# Altium schematic sheet MCU.SchDoc
size A4
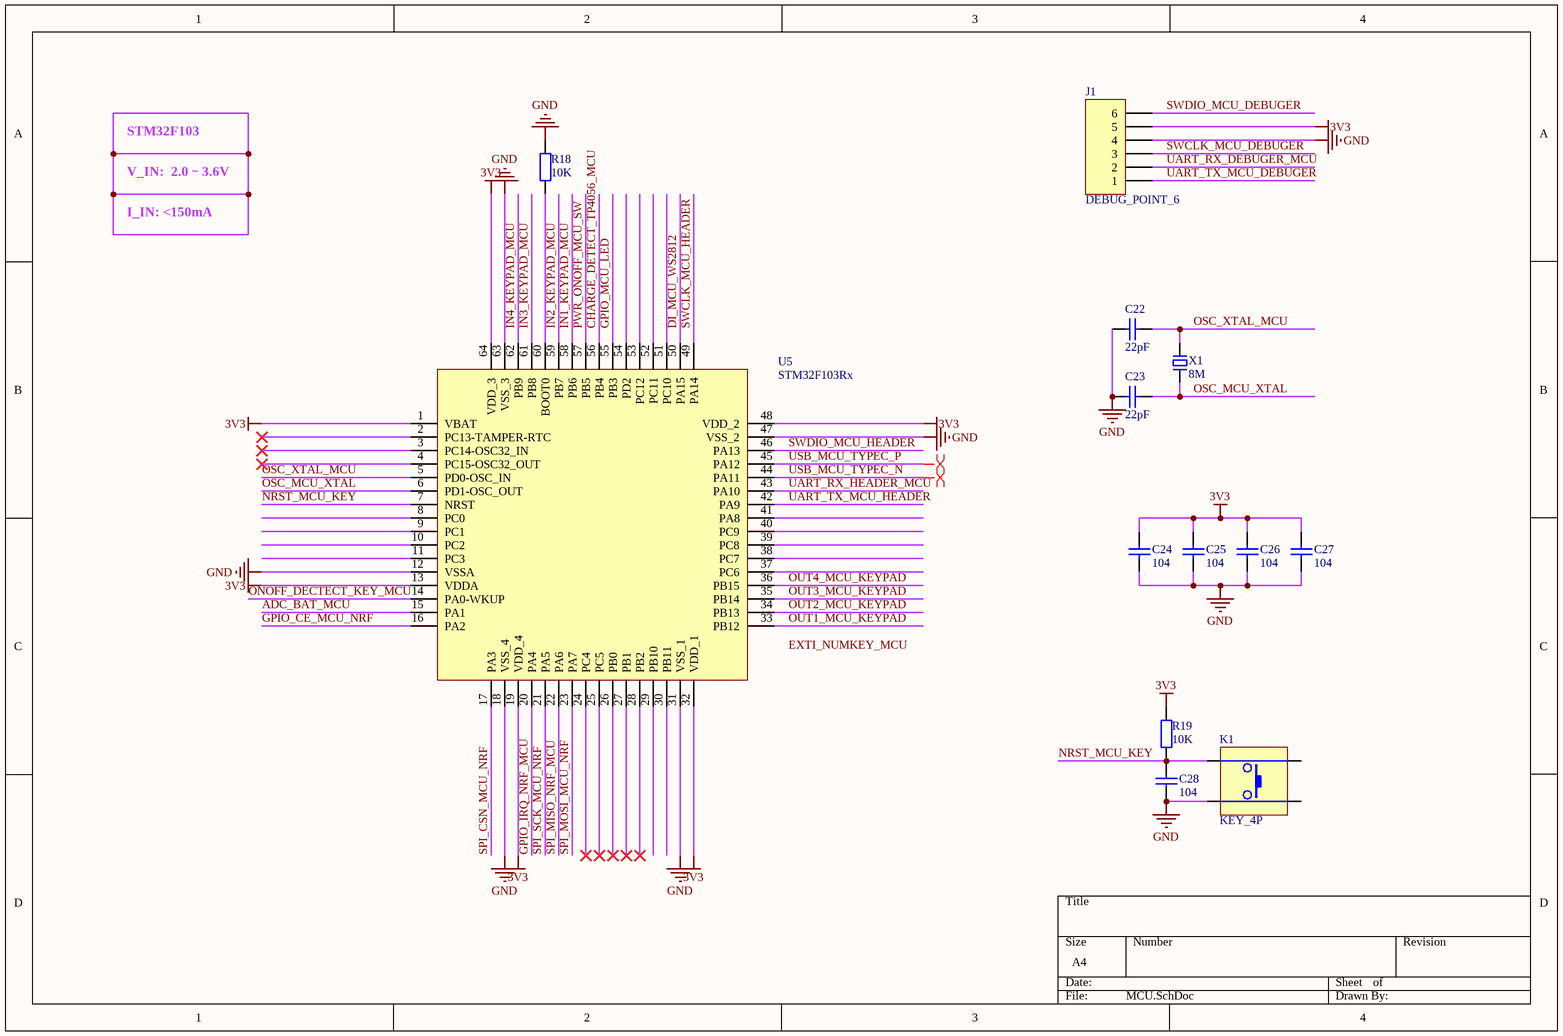
[diagram p0: MCU.SchDoc]

## Parts
C22  22pF  [Cap-0603]
C23  22pF  [Cap-0603]
C24  104  [Cap-0603]
C25  104  [Cap-0603]
C26  104  [Cap-0603]
C27  104  [Cap-0603]
C28  104  [Cap-0603]
J1  DEBUG_POINT_6  [DEBUG_POINT_6]
K1  KEY_4P  [SW-SMD-3X4X2.5]
R18  10K  [Res-0603]
R19  10K  [Res-0603]
U5  STM32F103Rx  [STM-LQFP64_N]
X1  8M  [OSC 5032-2P]

## Nets
3V3: C24.2 C25.2 C26.2 C27.2 J1.5 R19.2 U5.1(VBAT) U5.13(VDDA) U5.19(VDD_4) U5.32(VDD_1) U5.48(VDD_2) U5.64(VDD_3)
GND: C22.1 C23.1 C24.1 C25.1 C26.1 C27.1 C28.1 J1.4 K1.4 R18.2 U5.12(VSSA) U5.18(VSS_4) U5.31(VSS_1) U5.47(VSS_2) U5.63(VSS_3)
ADC_BAT_MCU: U5.15(PA1)
CHARGE_DETECT_TP4056_MCU: U5.56(PB4)
DI_MCU_WS2812: U5.50(PA15)
GPIO_CE_MCU_NRF: U5.16(PA2)
GPIO_IRQ_NRF_MCU: U5.20(PA4)
GPIO_MCU_LED: U5.55(PB3)
IN1_KEYPAD_MCU: U5.58(PB6)
IN2_KEYPAD_MCU: U5.59(PB7)
IN3_KEYPAD_MCU: U5.61(PB8)
IN4_KEYPAD_MCU: U5.62(PB9)
NRST_MCU_KEY: C28.2 K1.3 R19.1 U5.7(NRST)
ONOFF_DECTECT_KEY_MCU: U5.14(PA0-WKUP)
OSC_MCU_XTAL: C23.2 U5.6(PD1-OSC_OUT) X1.1
OSC_XTAL_MCU: C22.2 U5.5(PD0-OSC_IN) X1.2
OUT1_MCU_KEYPAD: U5.33(PB12)
OUT2_MCU_KEYPAD: U5.34(PB13)
OUT3_MCU_KEYPAD: U5.35(PB14)
OUT4_MCU_KEYPAD: U5.36(PB15)
PWR_ONOFF_MCU_SW: U5.57(PB5)
SPI_CSN_MCU_NRF: U5.17(PA3)
SPI_MISO_NRF_MCU: U5.22(PA6)
SPI_MOSI_MCU_NRF: U5.23(PA7)
SPI_SCK_MCU_NRF: U5.21(PA5)
SWCLK_MCU_DEBUGER: J1.3
SWCLK_MCU_HEADER: U5.49(PA14)
SWDIO_MCU_DEBUGER: J1.6
SWDIO_MCU_HEADER: U5.46(PA13)
UART_RX_DEBUGER_MCU: J1.2
UART_RX_HEADER_MCU: U5.43(PA10)
UART_TX_MCU_DEBUGER: J1.1
UART_TX_MCU_HEADER: U5.42(PA9)
USB_MCU_TYPEC_N: U5.44(PA11)
USB_MCU_TYPEC_P: U5.45(PA12)
NetR18_1: R18.1 U5.60(BOOT0)

Not connected (* = marked no-connect by the designer): K1 1 2; U5 2(PC13-TAMPER-RTC)* 3(PC14-OSC32_IN)* 4(PC15-OSC32_OUT)* 8(PC0) 9(PC1) 10(PC2) 11(PC3) 24(PC4)* 25(PC5)* 26(PB0)* 27(PB1)* 28(PB2)* 29(PB10) 30(PB11) 37(PC6) 38(PC7) 39(PC8) 40(PC9) 41(PA8) 51(PC10) 52(PC11) 53(PC12) 54(PD2)

## Layout directives
differential pair: USB_MCU_TYPEC_N, USB_MCU_TYPEC_P

## Notes on the sheet
- STM32F103
- V_IN:  2.0～3.6V
- I_IN: <150mA
- Labels drawn without touching a wire or pin: EXTI_NUMKEY_MCU

## Library data of the parts
C22-C28 = CAP: 贴片陶瓷电容
R18 R19 = RES: 贴片电阻
X1 = XTAL-2P: 2脚无源脚晶振